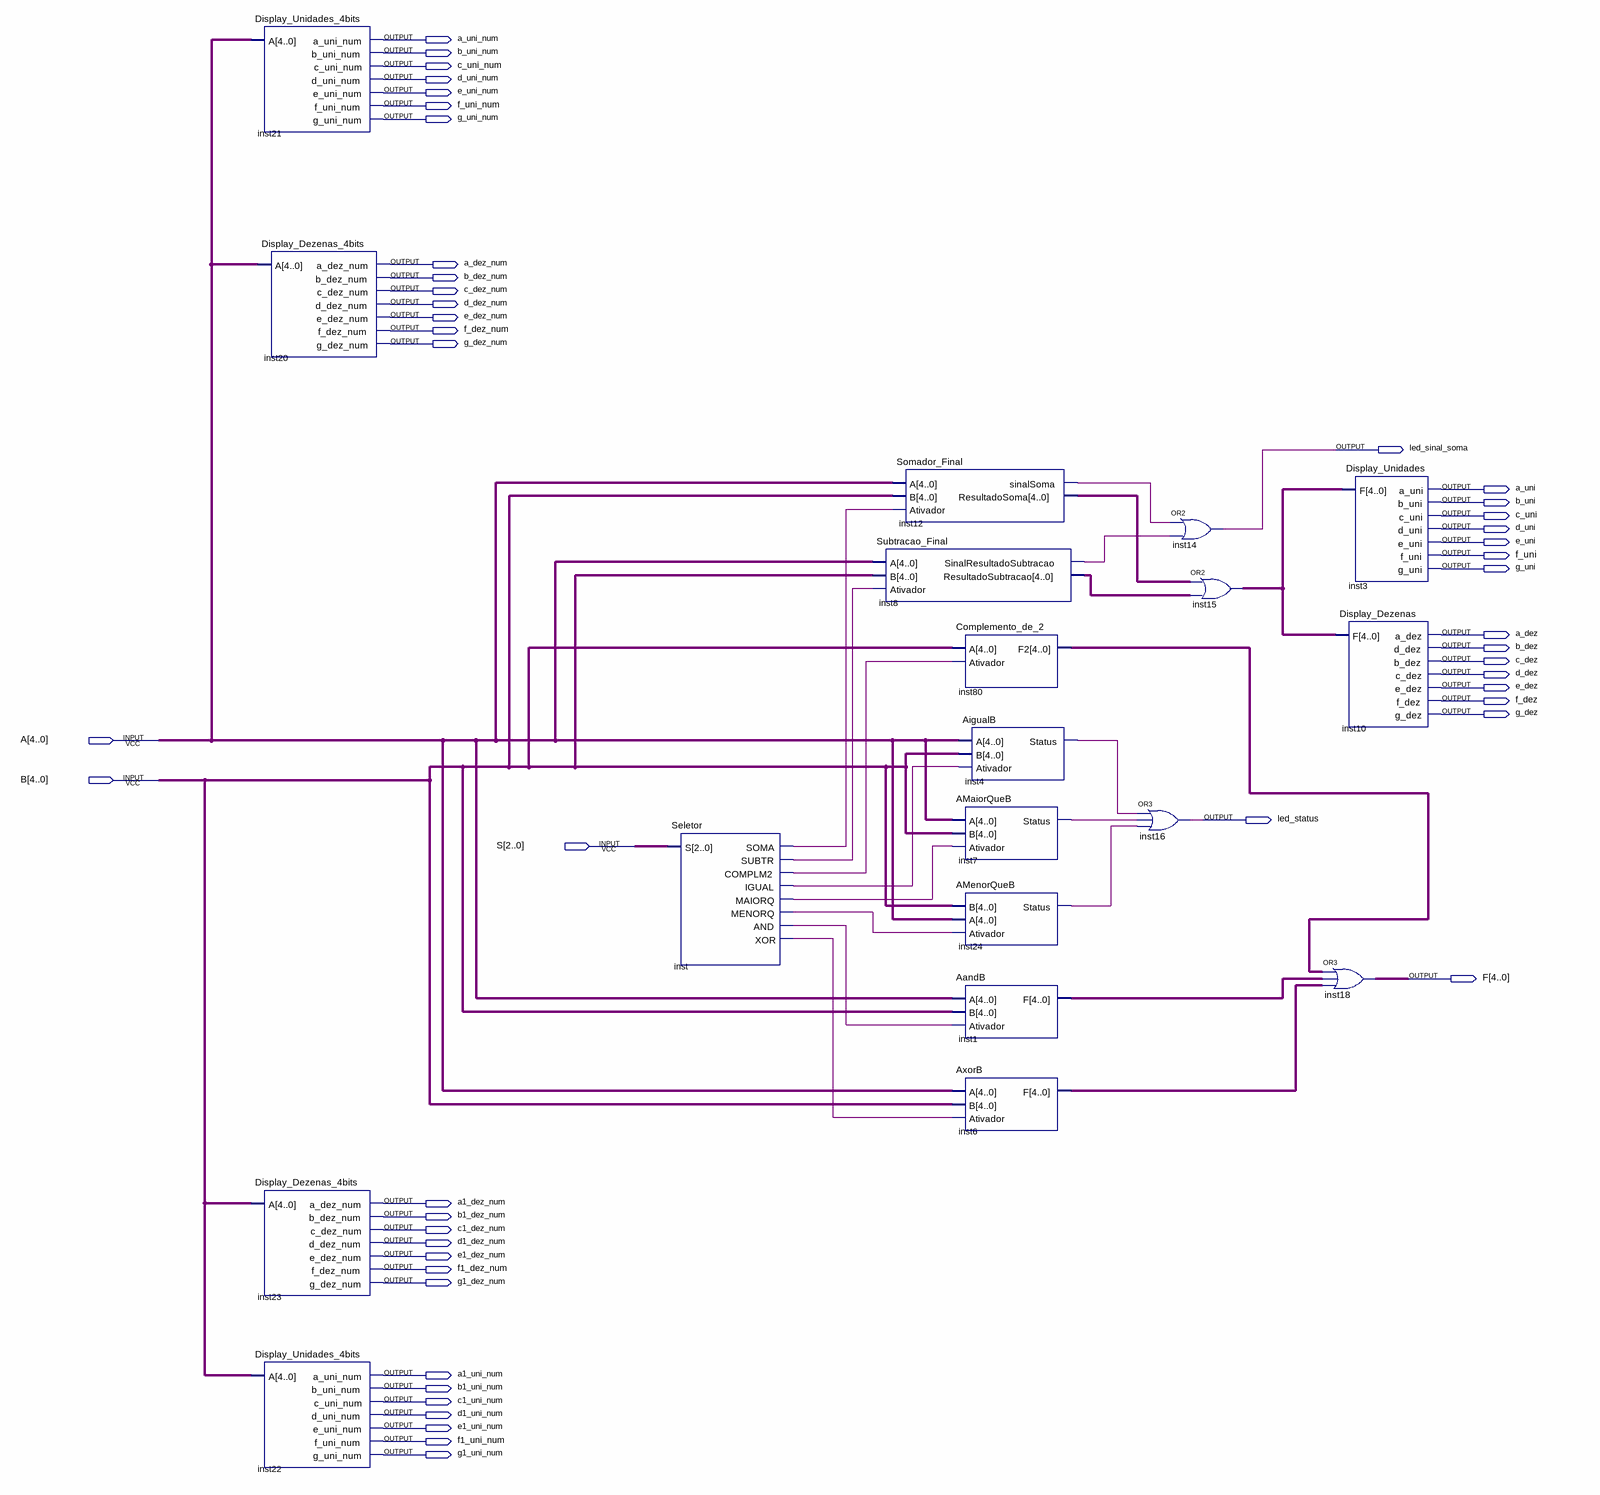
[diagram p0: schematic sheet]
// Quartus schematic Circuitao.bdf as structural Verilog: 19 symbols, 48 pins
module Circuitao (
  input  [4:0] A,
  input  [4:0] B,
  input  [2:0] S,
  output a_uni_num,
  output b_uni_num,
  output c_uni_num,
  output d_uni_num,
  output e_uni_num,
  output f_uni_num,
  output g_uni_num,
  output a_dez_num,
  output b_dez_num,
  output c_dez_num,
  output d_dez_num,
  output e_dez_num,
  output f_dez_num,
  output g_dez_num,
  output led_sinal_soma,
  output a_uni,
  output b_uni,
  output c_uni,
  output d_uni,
  output e_uni,
  output f_uni,
  output g_uni,
  output a_dez,
  output b_dez,
  output c_dez,
  output d_dez,
  output e_dez,
  output f_dez,
  output g_dez,
  output led_status,
  output [4:0] F,
  output a1_dez_num,
  output b1_dez_num,
  output c1_dez_num,
  output d1_dez_num,
  output e1_dez_num,
  output f1_dez_num,
  output g1_dez_num,
  output a1_uni_num,
  output b1_uni_num,
  output c1_uni_num,
  output d1_uni_num,
  output e1_uni_num,
  output f1_uni_num,
  output g1_uni_num
);

  wire inst4_status, inst7_status, inst8_sinalresultadosubtracao, inst12_sinalsoma, inst24_status, inst_and,
       inst_complm2, inst_igual, inst_maiorq, inst_menorq, inst_soma, inst_subtr, inst_xor;
  wire [4:0] inst1_f, inst6_f, inst8_resultadosubtracao, inst12_resultadosoma, inst15_out, inst80_f2;

  Display_Unidades_4bits inst21 (
    .A(A), .a_uni_num(a_uni_num), .b_uni_num(b_uni_num), .c_uni_num(c_uni_num), .d_uni_num(d_uni_num),
    .e_uni_num(e_uni_num), .f_uni_num(f_uni_num), .g_uni_num(g_uni_num));
  Display_Dezenas_4bits inst20 (
    .A(A), .a_dez_num(a_dez_num), .b_dez_num(b_dez_num), .c_dez_num(c_dez_num), .d_dez_num(d_dez_num),
    .e_dez_num(e_dez_num), .f_dez_num(f_dez_num), .g_dez_num(g_dez_num));
  Display_Dezenas_4bits inst23 (
    .A(B), .a_dez_num(a1_dez_num), .b_dez_num(b1_dez_num), .c_dez_num(c1_dez_num), .d_dez_num(d1_dez_num),
    .e_dez_num(e1_dez_num), .f_dez_num(f1_dez_num), .g_dez_num(g1_dez_num));
  Display_Unidades_4bits inst22 (
    .A(B), .a_uni_num(a1_uni_num), .b_uni_num(b1_uni_num), .c_uni_num(c1_uni_num), .d_uni_num(d1_uni_num),
    .e_uni_num(e1_uni_num), .f_uni_num(f1_uni_num), .g_uni_num(g1_uni_num));
  Seletor inst (
    .S(S), .SOMA(inst_soma), .SUBTR(inst_subtr), .COMPLM2(inst_complm2), .IGUAL(inst_igual),
    .MAIORQ(inst_maiorq), .MENORQ(inst_menorq), .AND(inst_and), .XOR(inst_xor));
  Subtracao_Final inst8 (
    .A(A), .B(B), .Ativador(inst_subtr), .SinalResultadoSubtracao(inst8_sinalresultadosubtracao),
    .ResultadoSubtracao(inst8_resultadosubtracao));
  Somador_Final inst12 (
    .A(A), .B(B), .Ativador(inst_soma), .sinalSoma(inst12_sinalsoma), .ResultadoSoma(inst12_resultadosoma));
  Complemento_de_2 inst80 (.A(B), .Ativador(inst_complm2), .F2(inst80_f2));
  AigualB inst4 (.A(A), .B(B), .Ativador(inst_igual), .Status(inst4_status));
  AMaiorQueB inst7 (.A(A), .B(B), .Ativador(inst_maiorq), .Status(inst7_status));
  AMenorQueB inst24 (.B(B), .A(A), .Ativador(inst_menorq), .Status(inst24_status));
  AandB inst1 (.A(A), .B(B), .Ativador(inst_and), .F(inst1_f));
  AxorB inst6 (.A(A), .B(B), .Ativador(inst_xor), .F(inst6_f));
  or inst16 (led_status, inst4_status, inst7_status, inst24_status);
  or inst14 (led_sinal_soma, inst12_sinalsoma, inst8_sinalresultadosubtracao);
  assign inst15_out = inst12_resultadosoma | inst8_resultadosubtracao;  // OR2 inst15, 5 bits wide
  Display_Unidades inst3 (
    .F(inst15_out), .a_uni(a_uni), .b_uni(b_uni), .c_uni(c_uni), .d_uni(d_uni), .e_uni(e_uni), .f_uni(f_uni),
    .g_uni(g_uni));
  Display_Dezenas inst10 (
    .F(inst15_out), .a_dez(a_dez), .d_dez(b_dez), .b_dez(c_dez), .c_dez(d_dez), .e_dez(e_dez), .f_dez(f_dez),
    .g_dez(g_dez));
  assign F = inst80_f2 | inst1_f | inst6_f;  // OR3 inst18, 5 bits wide
endmodule
